# Altium schematic sheet ethernet_2.SchDoc
size A2; Scale: 1:1; DocumentType: Схема электрическая принципиальная; FirstReferrence: АБВГ.123456.001
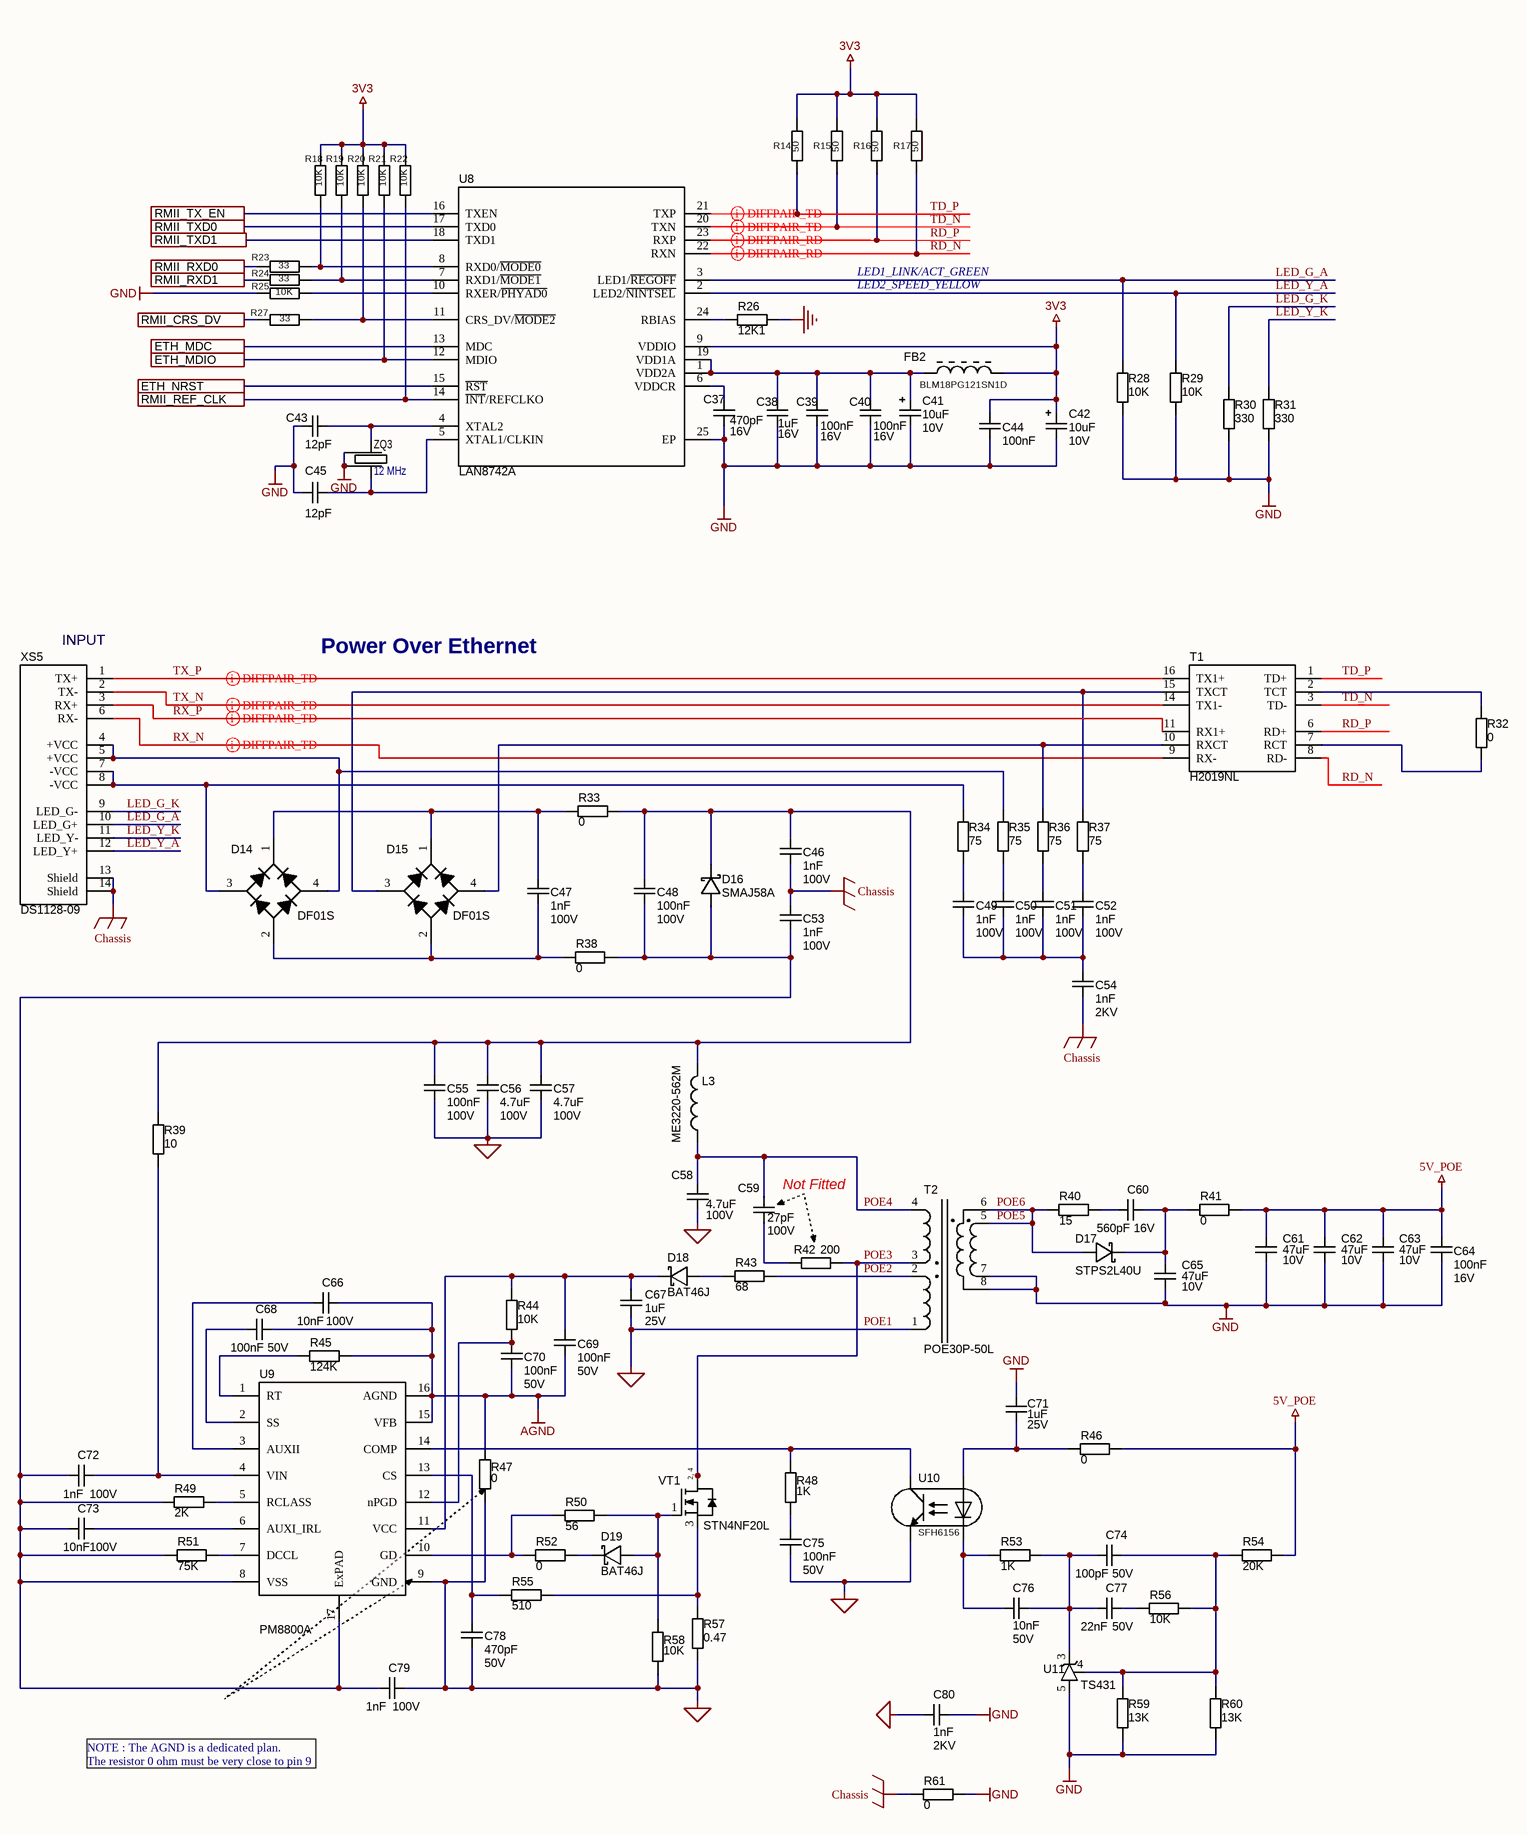
[diagram p0: ethernet_2.SchDoc]

## Parts
C37  value 470pF  Voltage: 16V  [C0603]  (hidden comment: C0603)
C38  value 1uF  Voltage: 16V  [C0603]  (hidden comment: C0603)
C39  value 100nF  Voltage: 16V  [C0603]  (hidden comment: C0603)
C40  value 100nF  Voltage: 16V  [C0603]  (hidden comment: C0603)
C41  value 10uF  Voltage: 10V  [TPSA106K010R1800]  (hidden comment: TPSA106K010R0900)
C42  value 10uF  Voltage: 10V  [TPSA106K010R1800]  (hidden comment: TPSA106K010R0900)
C43  value 12pF  [C0603]  (hidden comment: C0603)
C44  value 100nF  [C0603]  (hidden comment: C0603)
C45  value 12pF  [C0603]  (hidden comment: C0603)
C46  value 1nF  Voltage: 100V  [C0603]  (hidden comment: C0603)
C47  value 1nF  Voltage: 100V  [C0603]  (hidden comment: C0603)
C48  value 100nF  Voltage: 100V  [C0805]  (hidden comment: C0805)
C49  value 1nF  Voltage: 100V  [C0603]  (hidden comment: C0603)
C50  value 1nF  Voltage: 100V  [C0603]  (hidden comment: C0603)
C51  value 1nF  Voltage: 100V  [C0603]  (hidden comment: C0603)
C52  value 1nF  Voltage: 100V  [C0603]  (hidden comment: C0603)
C53  value 1nF  Voltage: 100V  [C0603]  (hidden comment: C0603)
C54  value 1nF  Voltage: 2KV  [C1206(3216)]  (hidden comment: C1206)
C55  value 100nF  Voltage: 100V  [C0805]  (hidden comment: C0805)
C56  value 4.7uF  Voltage: 100V  [C2220]  (hidden comment: C2220)
C57  value 4.7uF  Voltage: 100V  [C2220]  (hidden comment: C2220)
C58  value 4.7uF  Voltage: 100V  [C2220]  (hidden comment: C2220)
C59  value 27pF  Voltage: 100V  [C0603]  (hidden comment: C0603)
C60  value 560pF  Voltage: 16V  [C0603]  (hidden comment: C0603)
C61  value 47uF  Voltage: 10V  [C0805]  (hidden comment: C0805)
C62  value 47uF  Voltage: 10V  [C0805]  (hidden comment: C0805)
C63  value 47uF  Voltage: 10V  [C0805]  (hidden comment: C0805)
C64  value 100nF  Voltage: 16V  [C0603]  (hidden comment: C0603)
C65  value 47uF  Voltage: 10V  [C0805]  (hidden comment: C0805)
C66  value 10nF  Voltage: 100V  [C0603]  (hidden comment: C0603)
C67  value 1uF  Voltage: 25V  [C0603]  (hidden comment: C0603)
C68  value 100nF  Voltage: 50V  [C0603]  (hidden comment: C0603)
C69  value 100nF  Voltage: 50V  [C0603]  (hidden comment: C0603)
C70  value 100nF  Voltage: 50V  [C0603]  (hidden comment: C0603)
C71  value 1uF  Voltage: 25V  [C0603]  (hidden comment: C0603)
C72  value 1nF  Voltage: 100V  [C0603]  (hidden comment: C0603)
C73  value 10nF  Voltage: 100V  [C0603]  (hidden comment: C0603)
C74  value 100pF  Voltage: 50V  [C0603]  (hidden comment: C0603)
C75  value 100nF  Voltage: 50V  [C0603]  (hidden comment: C0603)
C76  value 10nF  Voltage: 50V  [C0603]  (hidden comment: C0603)
C77  value 22nF  Voltage: 50V  [C0603]  (hidden comment: C0603)
C78  value 470pF  Voltage: 50V  [C0603]  (hidden comment: C0603)
C79  value 1nF  Voltage: 100V  [C0603]  (hidden comment: C0603)
C80  value 1nF  Voltage: 2KV  [C1206(3216)]  (hidden comment: C1206)
D14  DF01S  [SDIP-4]
D15  DF01S  [SDIP-4]
D16  SMAJ58A  [DO-214AC-2_N]
D17  STPS2L40U  [SMB-2]
D18  BAT46J  [SOD-323-2]
D19  BAT46J  [SOD-323-2]
FB2  BLM18PG121SN1D  [BLM18]
L3  Model: ME3220-562M  [ME3220]  (hidden comment: ME3220)
R14  value 50  [SMD0603]  (hidden comment: R0603)
R15  value 50  [SMD0603]  (hidden comment: R0603)
R16  value 50  [SMD0603]  (hidden comment: R0603)
R17  value 50  [SMD0603]  (hidden comment: R0603)
R18  value 10K  [SMD0603]  (hidden comment: R0603)
R19  value 10K  [SMD0603]  (hidden comment: R0603)
R20  value 10K  [SMD0603]  (hidden comment: R0603)
R21  value 10K  [SMD0603]  (hidden comment: R0603)
R22  value 10K  [SMD0603]  (hidden comment: R0603)
R23  value 33  [SMD0603]  (hidden comment: R0603)
R24  value 33  [SMD0603]  (hidden comment: R0603)
R25  value 10K  [SMD0603]  (hidden comment: R0603)
R26  value 12K1  [SMD0603]  (hidden comment: R0603)
R27  value 33  [SMD0603]  (hidden comment: R0603)
R28  value 10K  [SMD0603]  (hidden comment: R0603)
R29  value 10K  [SMD0603]  (hidden comment: R0603)
R30  value 330  [SMD0603]  (hidden comment: R0603)
R31  value 330  [SMD0603]  (hidden comment: R0603)
R32  value 0  [SMD0805]  (hidden comment: R0805)
R33  value 0  [SMD0805]  (hidden comment: R0805)
R34  value 75  [SMD0805]  (hidden comment: R0805)
R35  value 75  [SMD0805]  (hidden comment: R0805)
R36  value 75  [SMD0805]  (hidden comment: R0805)
R37  value 75  [SMD0805]  (hidden comment: R0805)
R38  value 0  [SMD0805]  (hidden comment: R0805)
R39  value 10  [SMD0805]  (hidden comment: R0805)
R40  value 15  [SMD0805]  (hidden comment: R0805)
R41  value 0  [SMD0603]  (hidden comment: R0603)
R42  value 200  [R1206(3216)]  (hidden comment: R1206)
R43  value 68  [SMD0805]  (hidden comment: R0805)
R44  value 10K  [SMD0603]  (hidden comment: R0603)
R45  value 124K  [SMD0603]  (hidden comment: R0603)
R46  value 0  [SMD0805]  (hidden comment: R0805)
R47  value 0  [SMD0603]  (hidden comment: R0603)
R48  value 1K  [SMD0603]  (hidden comment: R0603)
R49  value 2K  [SMD0603]  (hidden comment: R0603)
R50  value 56  [SMD0805]  (hidden comment: R0805)
R51  value 75K  [SMD0603]  (hidden comment: R0603)
R52  value 0  [SMD0603]  (hidden comment: R0603)
R53  value 1K  [SMD0603]  (hidden comment: R0603)
R54  value 20K  [SMD0603]  (hidden comment: R0603)
R55  value 510  [SMD0603]  (hidden comment: R0603)
R56  value 10K  [SMD0603]  (hidden comment: R0603)
R57  value 0.47  [R1206(3216)]  (hidden comment: R1206)
R58  value 10K  [SMD0603]  (hidden comment: R0603)
R59  value 13K  [SMD0603]  (hidden comment: R0603)
R60  value 13K  [SMD0603]  (hidden comment: R0603)
R61  value 0  [SMD0805]  (hidden comment: R0805)
T1  H2019NL  [H2019NL]
T2  POE30P-50L  [POE30P]
U8  LAN8742A  [QFN-24]
U9  PM8800A  [HTSSOP16]
U10  SFH6156  [SFH6156(VISH)]
U11  TS431  [SOT-23-5]
VT1  STN4NF20L  [SOT-223]
XS5  DS1128-09  [RJ45-AMPH]
ZQ3  12 MHz  [NX3225]

## Ports
ETH_MDC, ETH_MDIO, ETH_NRST, RMII_CRS_DV, RMII_REF_CLK, RMII_RXD0, RMII_RXD1, RMII_TX_EN, RMII_TXD0, RMII_TXD1

## Nets
3V3: C42.1 C44.1 FB2.2 R14.2 R15.2 R16.2 R17.2 R18.2 R19.2 R20.2 R21.2 R22.2 U8.9(VDDIO)
5V_POE: C61.2 C62.2 C63.2 C64.1 R41.2 R46.2 R54.1
AGND: C66.2 C68.2 C69.1 C70.1 R45.2 R47.2 U9.15(VFB) U9.16(AGND)
Chassis: C46.1 C53.2 C54.1 R61.1 XS5.13(Shield) XS5.14(Shield)
GND: C37.2 C38.2 C39.2 C40.2 C41.2 C42.2 C43.2 C44.2 C45.2 C61.1 C62.1 C63.1 C64.2 C65.1 C71.2 C80.2 R25.1 R26.1 R28.1 R29.1 R30.1 R31.1 R59.2 R60.2 R61.2 T2.7 T2.8 U8.25(EP) U11.5(A) ZQ3.2 ZQ3.4
POE1: C55.1 C56.1 C57.1 C58.2 C67.1 C75.1 C78.1 C79.1 C80.1 R47.1 R57.1 R58.1 T2.1 U9.9(GND) U10.3(E)  [also labelled GND_POWER_IN]
ETH_MDC: U8.13(MDC) ; port ETH_MDC
ETH_MDIO: R21.1 U8.12(MDIO) ; port ETH_MDIO
ETH_NRST: U8.15(~{RST}) ; port ETH_NRST
LED_G_A: R28.2 U8.3(LED1/~{REGOFF}) XS5.10(LED_G+)
LED_G_K: R30.2 XS5.9(LED_G-)
LED_Y_A: R29.2 U8.2(LED2/~{NINTSEL}) XS5.12(LED_Y+)
LED_Y_K: R31.2 XS5.11(LED_Y-)
POE2: R43.2 T2.2
POE3: R42.2 T2.3 VT1.2(D) VT1.4(D)
POE4: C58.1 C59.2 L3.1 T2.4
POE5: D17.1(A) R40.1 T2.5 T2.6  [also labelled POE6]
RD_N: R17.1 T1.8(RD-) U8.22(RXN)
RD_P: R16.1 T1.6(RD+) U8.23(RXP)
RMII_CRS_DV: R27.2 ; port RMII_CRS_DV
RMII_REF_CLK: R22.1 U8.14(~{INT}/REFCLKO) ; port RMII_REF_CLK
RMII_RXD0: R23.2 ; port RMII_RXD0
RMII_RXD1: R24.2 ; port RMII_RXD1
RMII_TX_EN: U8.16(TXEN) ; port RMII_TX_EN
RMII_TXD0: U8.17(TXD0) ; port RMII_TXD0
RMII_TXD1: U8.18(TXD1) ; port RMII_TXD1
RX_N: T1.9(RX-) XS5.6(RX-)
RX_P: T1.11(RX1+) XS5.3(RX+)
TD_N: R15.1 T1.3(TD-) U8.20(TXN)
TD_P: R14.1 T1.1(TD+) U8.21(TXP)
TX_N: T1.14(TX1-) XS5.2(TX-)
TX_P: T1.16(TX1+) XS5.1(TX+)
NetC37_1: C37.1 U8.6(VDDCR)
NetC38_1: C38.1 C39.1 C40.1 C41.1 FB2.1 U8.1(VDD2A) U8.19(VDD1A)
NetC43_1: C43.1 U8.4(XTAL2) ZQ3.3
NetC45_1: C45.1 U8.5(XTAL1/CLKIN) ZQ3.1
NetC46_2: C46.2 C48.2 C55.2 C56.2 C57.2 D16.2(K) L3.2 R33.2 R39.2
NetC47_1: C47.1 D14.2(A) D15.2(A) R38.1
NetC47_2: C47.2 D14.1(K) D15.1(K) R33.1
NetC48_1: C48.1 C53.1 C72.1 C73.1 C79.2 D16.1(A) R38.2 R49.1 R51.1 U9.8(VSS) U9.17(ExPAD)
NetC49_1: C49.1 C50.1 C51.1 C52.1 C54.2
NetC49_2: C49.2 R34.1
NetC50_2: C50.2 R35.1
NetC51_2: C51.2 R36.1
NetC52_2: C52.2 R37.1
NetC59_1: C59.1 R42.1
NetC60_1: C60.1 C65.2 D17.2(K) R41.1
NetC60_2: C60.2 R40.2
NetC66_1: C66.1 U9.3(AUXII)
NetC67_2: C67.2 C69.2 D18.2(K) R44.1 U9.11(VCC)
NetC68_1: C68.1 U9.2(SS)
NetC70_2: C70.2 R44.2 U9.12(nPGD)
NetC71_1: C71.1 R46.1 U10.1(A)
NetC72_2: C72.2 R39.1 U9.4(VIN)
NetC73_2: C73.2 U9.6(AUXI_IRL)
NetC74_1: C74.1 R54.2 R56.1 R59.1 R60.1 U11.4
NetC74_2: C74.2 C76.1 C77.1 R53.1 U11.3(K)
NetC75_2: C75.2 R48.1
NetC76_2: C76.2 R53.2 U10.2(C)
NetC77_2: C77.2 R56.2
NetC78_2: C78.2 R55.1 U9.13(CS)
NetD14_3: D14.3(C) R34.2 XS5.7(-VCC) XS5.8(-VCC)
NetD14_4: D14.4(C) R35.2 XS5.4(+VCC) XS5.5(+VCC)
NetD15_3: D15.3(C) R37.2 T1.15(TXCT)
NetD15_4: D15.4(C) R36.2 T1.10(RXCT)
NetD18_1: D18.1(A) R43.1
NetD19_1: D19.1(A) R50.2 R58.2 VT1.1(G)
NetD19_2: D19.2(K) R52.2
NetR18_1: R18.1 R23.1 U8.8(RXD0/~{MODE0})
NetR19_1: R19.1 R24.1 U8.7(RXD1/~{MODE1})
NetR20_1: R20.1 R27.1 U8.11(CRS_DV/~{MODE2})
NetR25_2: R25.2 U8.10(RXER/~{PHYAD0})
NetR26_2: R26.2 U8.24(RBIAS)
NetR32_1: R32.1 T1.2(TCT)
NetR32_2: R32.2 T1.7(RCT)
NetR45_1: R45.1 U9.1(RT)
NetR48_2: R48.2 U9.14(COMP) U10.4(C)
NetR49_2: R49.2 U9.5(RCLASS)
NetR50_1: R50.1 R52.1 U9.10(GD)
NetR51_2: R51.2 U9.7(DCCL)
NetR55_2: R55.2 R57.2 VT1.3(S)

## Layout directives
differential pair: RD_N, RD_P, RX_N, RX_P, TD_N, TD_P, TX_N, TX_P

## Notes on the sheet
- LED2_SPEED_YELLOW
- LED1_LINK/ACT_GREEN
- (near XS5) INPUT
- Power Over Ethernet
- (near C59) Not Fitted
- NOTE : The AGND is a dedicated plan.
  The resistor 0 ohm must be very close to pin 9
- Title
- Size:
- Date:
- File:
- A2
- Number:
- Time:
- Revision:
- Sheet
- of
- (in symbol STN4NF20L) 2, 4

## Library data of the parts
C41 C42 = TPSA106K010R0900: CAP TANT 10UF 10% 10V 1206; Model: TPSA106K010R0900
C43 C45 = C0603: Voltage: *V; Model: *
C44 = C0603: Voltage: 16V; Model: *
C55 = C0805: Model: 08051C104KAT2A
C61-C63 C65 = C0805: Model: GRM21BR61A476ME15L
D14 D15 = DF01S: BRIDGE RECT 1P 100V 1.5A 4SDIP
D16 = SMAJ58A: TVS DIODE 58V 93.6V DO214AC
D17 = STPS2L40U: DIODE SCHOTTKY 40V 2A SMB
D18 D19 = BAT46J: DIODE SCHOTTKY 100V 150MA SOD323
FB2 = BLM18: Ferrite Bead 0603; Resistance: * Ohm; DC Current Rating: * A
L3 = ME3220: SMT Power Inductor; Value: *
T1 = H2019NL: MODULE XFRMR VOIP SGL LAN 16SOIC; MF: Pulse Electronics; Package: SOIC-16 Pulse; Availability: Unavailable; MP: H2019NL; Price: None; SnapEDA_Link: https://www.snapeda.com/parts/H2019NL/Pulse%20Electronics%20Network/view-part/?ref=snap; Value: *
T2 = POE30P-50L: PoE transformer, SMT
U8 = LAN8742A: RMII 10/100 Eth Transceiver Microchip
U11 = TS431: IC VREF SHUNT ADJ SOT23-5
VT1 = STN4NF20L: MOSFET N-CH 200V 1A
XS5 = DS1128-09: Single Port RJ45 Connector
ZQ3 = Crystal_4: DSX321G
C37-C40 C46 C47 C49-C53 C59 C60 C64 C66-C79 = C0603: Model: *
C48 = C0805: Model: *
C54 C80 = C1206: Model: *
C56-C58 = C2220: Model: *